# EAGLE design light_connect (EAGLE 8.4.2)

## Sheet 1 of 2
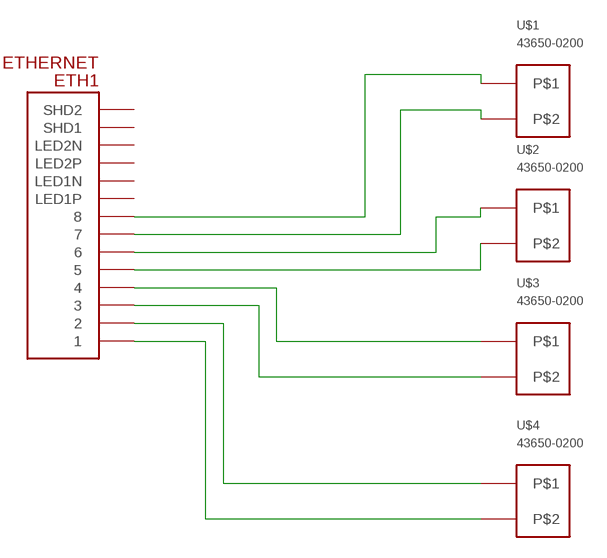
[diagram p0: schematic, sheet 1]

### Parts
ETH1  ETHERNET  [A122645-ND]
U$1  43650-0200  [43650-0200]
U$2  43650-0200  [43650-0200]
U$3  43650-0200  [43650-0200]
U$4  43650-0200  [43650-0200]

### Nets
N$1: ETH1.P$1 U$4.P$1
N$2: ETH1.P$2 U$4.P$2
N$3: ETH1.P$3 U$3.P$1
N$4: ETH1.P$4 U$3.P$2
N$5: ETH1.P$5 U$2.P$1
N$6: ETH1.P$6 U$2.P$2
N$7: ETH1.P$7 U$1.P$1
N$8: ETH1.P$8 U$1.P$2
Unconnected: ETH1.P$9(LED1N) ETH1.P$10(LED1P) ETH1.P$11(LED2N) ETH1.P$12(LED2P) ETH1.P$13(SHD1) ETH1.P$14(SHD2)

## Sheet 2 of 2

## Library data of the parts
ETH1 = ETHERNET:ETHERNET: Ethernet port with 2 leds. digikey number A122645-ND
U$1-U$4 = Shell2013:43650-0200

## Board
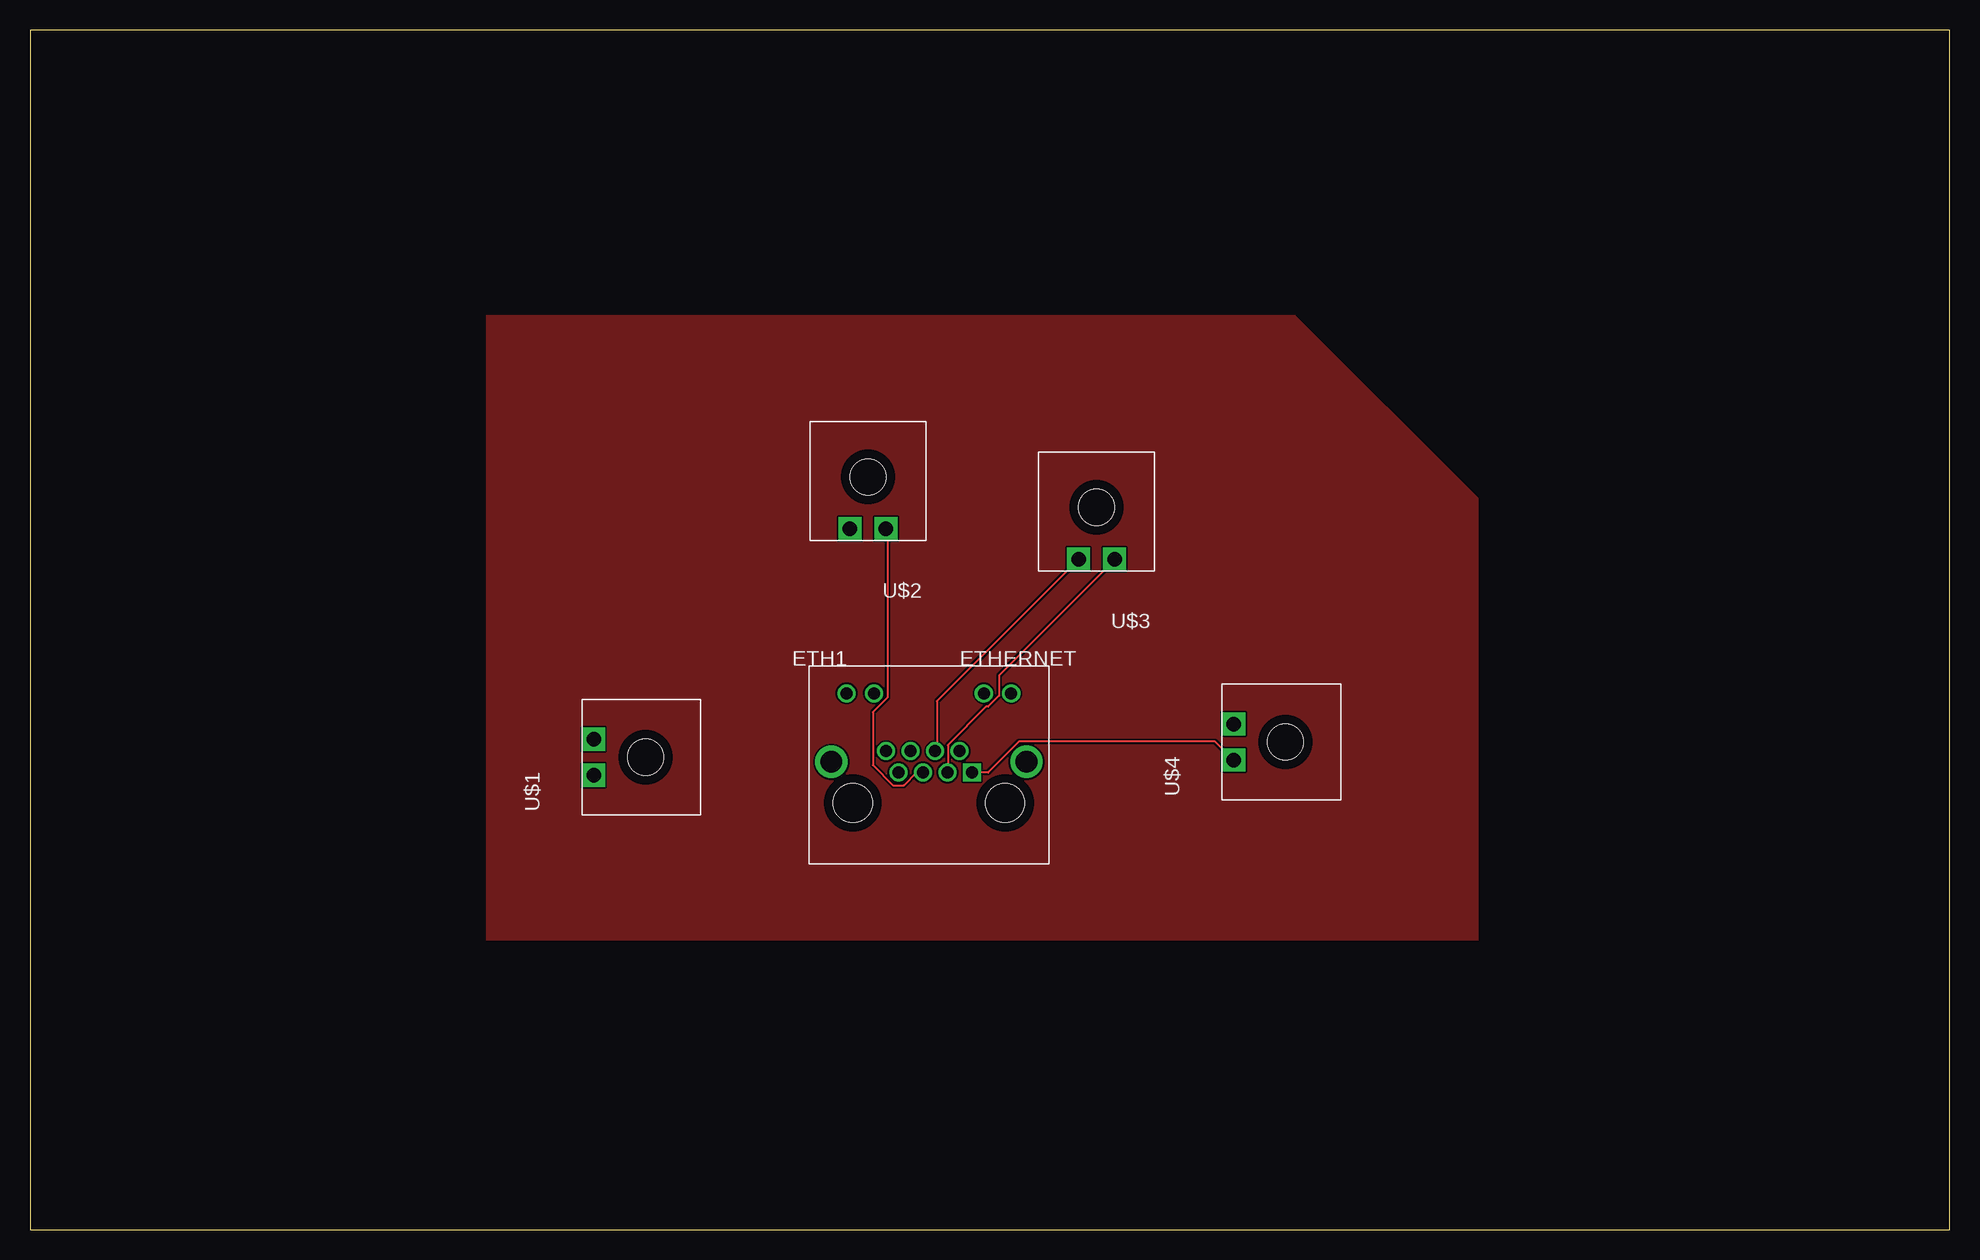
[diagram p1: board, top side]
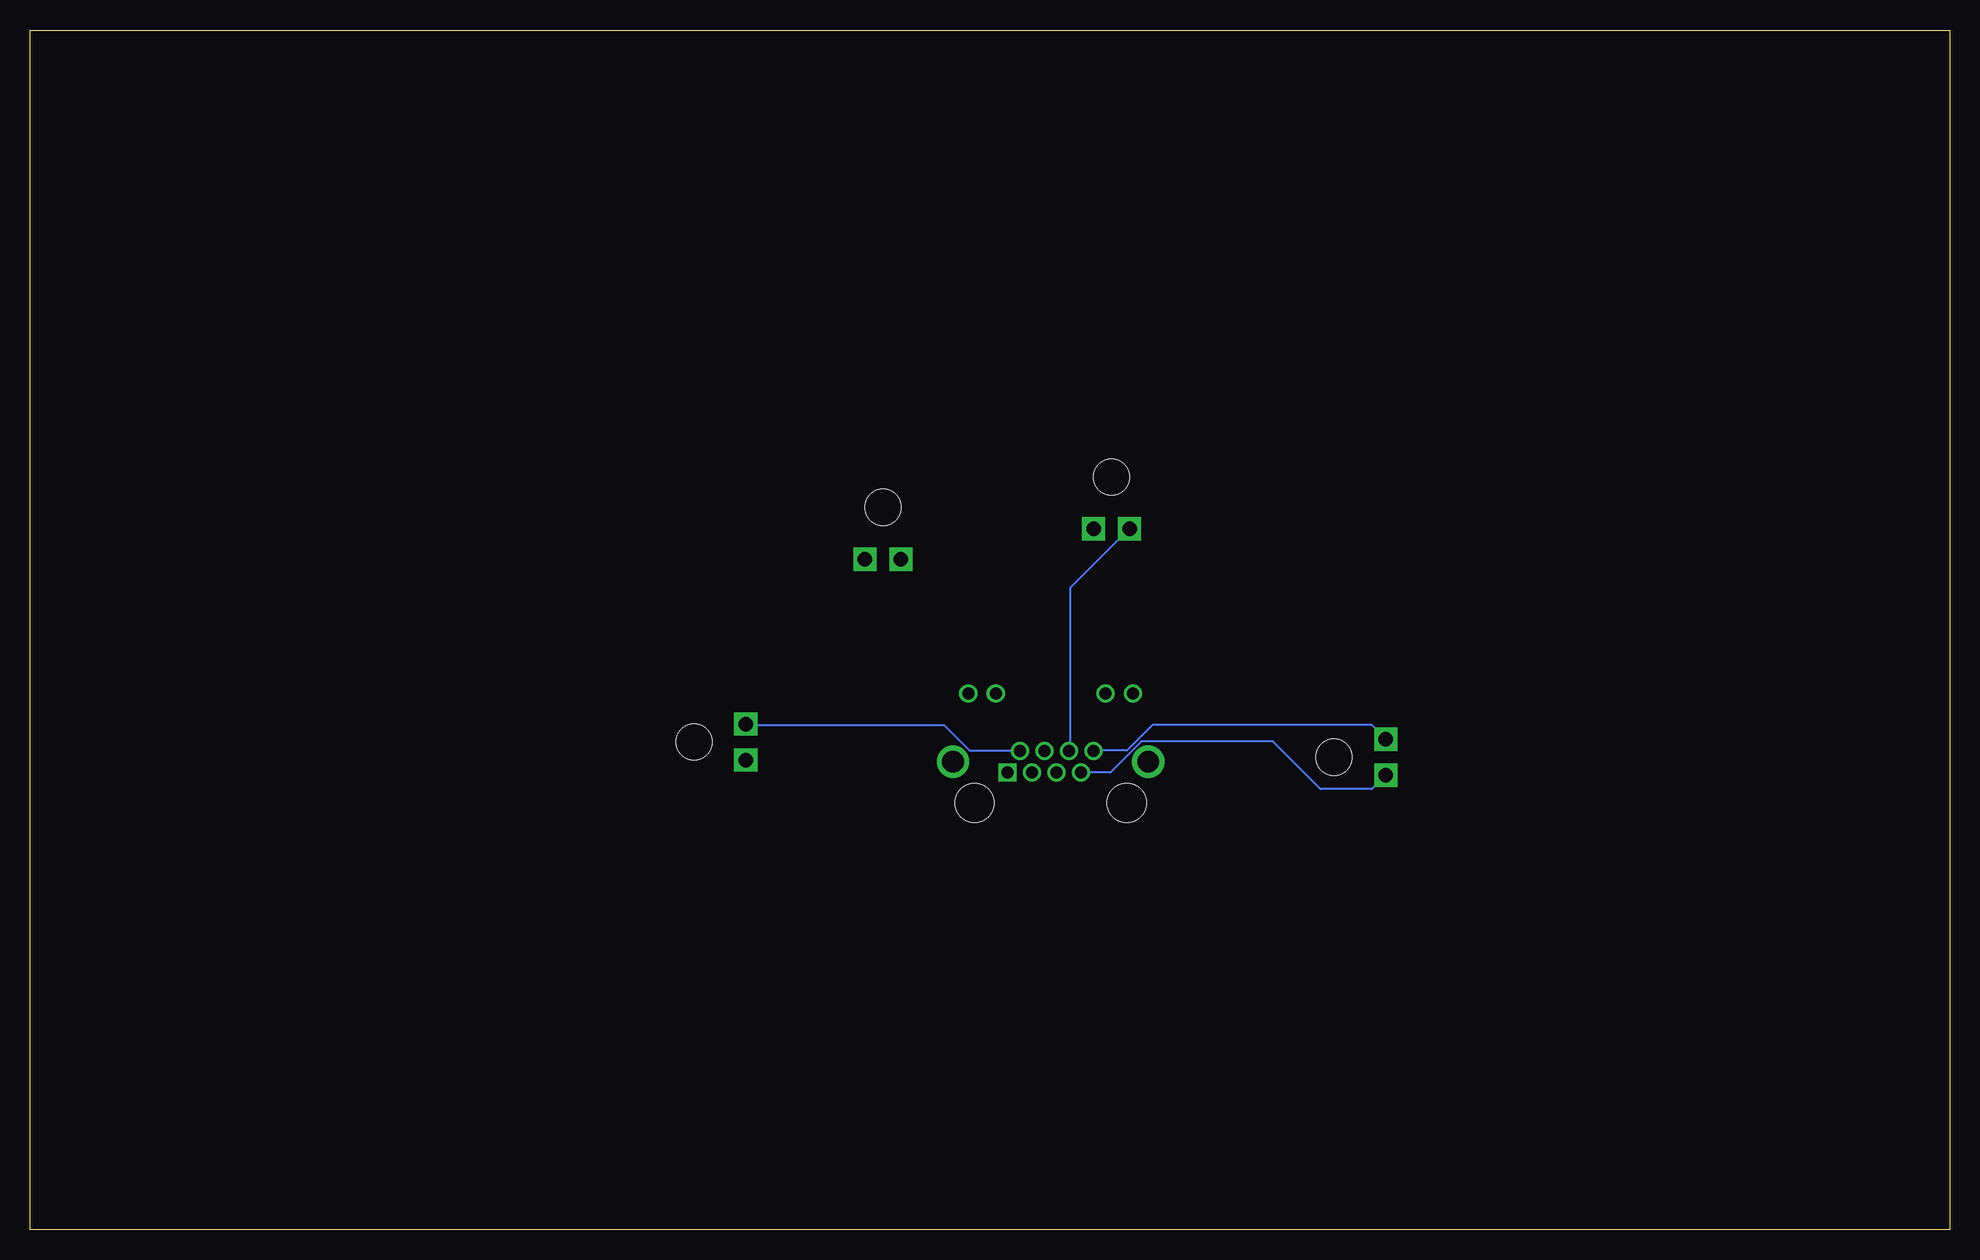
[diagram p2: board, bottom side, seen from below]

Size 160 x 100 mm. Coordinates in mm from the lower left corner, seen from the top.
Outline: 0,0 160,0 160,100 0,100 0,0
Copper layers (1*16): Top 0.035mm / dielectric 1.5mm / Bottom 0.035mm
Design rules "default *": minimum track width 6mil, minimum drill 0.35mm, track to track 6mil, track to pad 6mil, pad to pad 6mil, via to via 6mil, smd to smd 6mil, copper to edge 30mil, drill to drill 6mil, minimum pad ring 10mil, minimum via ring 8mil, stop-mask expansion 4mil, vias tented up to drill 0mil, thermal gap 10mil

### Footprints (pad centres in the part's own frame; a part is rotated, then mirrored left to right if it is on the bottom)
A122645-ND = drill 1 square: P$1 3.58,2.54 | drill 1: P$2 2.56,4.32; P$3 1.54,2.54; P$4 0.52,4.32; P$5 -0.5,2.54; P$6 -1.52,4.32; P$7 -2.54,2.54; P$8 -3.56,4.32; P$9 -6.86,9.14; P$10 -4.57,9.14; P$11 4.57,9.14; P$12 6.86,9.14 | drill 1.8: P$13 -8.13,3.43; P$14 8.13,3.43 | hole 3.25: -6.35,0; 6.35,0
43650-0200 = drill 1.2 pad 1.93 square: P$1 -1.5,0; P$2 1.5,0 | hole 3: 0,-4.32

### Placement (x,y rotation side)
ETH1  74.93,35.56 0 top
U$1  46.99,39.37 90 top
U$2  69.85,58.42 180 top
U$3  88.9,55.88 180 top
U$4  100.33,40.64 90 top

### Tracks (layer width: path | path; a pad name or v marks a point on that pad's centre or on a via)
GND
  pour Top: 40.64,76.2 105.41,76.2 120.65,60.96 120.65,24.13 38.1,24.13 38.1,76.2
N$1
  Top 0.152: ETH1.P$1 79.86,38.1 82.45,40.69 98.75,40.69 100.28,39.17 U$4.P$1
N$2
  Bottom 0.152: ETH1.P$2 77.57,39.93 81.69,39.93 83.82,42.06 100.28,42.06 U$4.P$2
N$3
  Top 0.152: ETH1.P$3 76.5,38.1 76.5,40.39 79.7,43.59 79.86,43.59 80.77,44.5 80.77,46.18 90.37,55.78 U$3.P$1
N$4
  Top 0.152: ETH1.P$4 75.59,39.93 75.59,44.04 87.33,55.78 U$3.P$2
N$5
  Top 0.152: ETH1.P$5 73.91,38.1 72.85,37.03 71.93,37.03 70.26,38.71 70.26,43.13 71.48,44.35 71.48,58.37 U$2.P$1
N$6
  Bottom 0.152: ETH1.P$6 73.3,39.93 73.3,53.49 68.43,58.37 U$2.P$2
N$7
  Bottom 0.152: ETH1.P$7 69.95,38.1 67.36,40.69 56.39,40.69 52.43,36.73 48.16,36.73 47.09,37.8 U$1.P$1
N$8
  Bottom 0.152: ETH1.P$8 71.32,39.93 68.58,39.93 66.45,42.06 48.16,42.06 47.09,41 U$1.P$2